# EAGLE schematic luxometro_16F1709 (EAGLE 7.1.0)
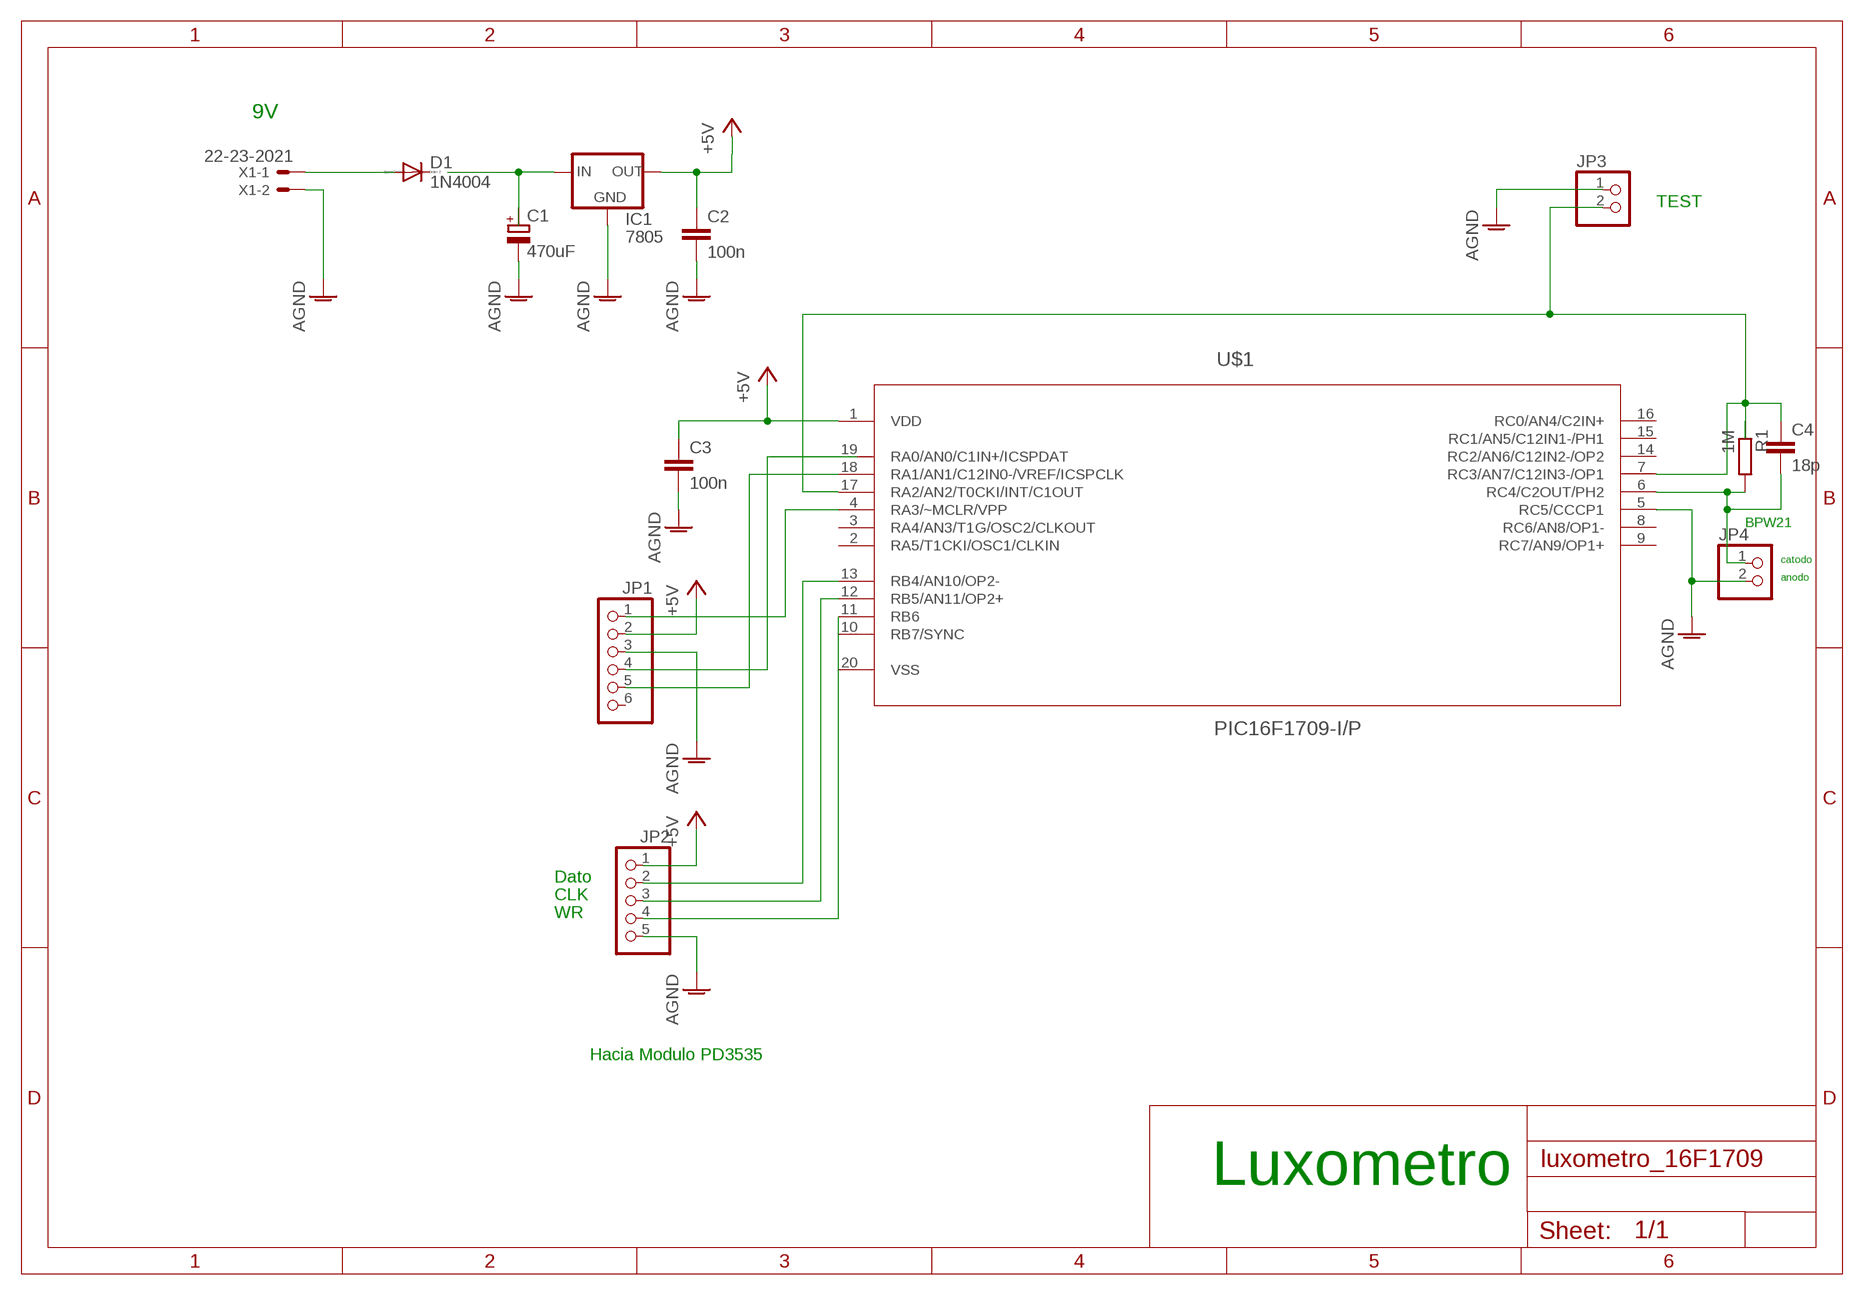
[diagram p0: schematic, sheet 1]

## Parts
C1  470uF  CPOL-EUE2,5-6E  [E2,5-6E]
C2  100n  C-EU050-024X044  [C050-024X044]
C3  100n  C-EU050-024X044  [C050-024X044]
C4  18p  C-EU050-024X044  [C050-024X044]
D1  1N4004  [DO41-10]
IC1  7805  78XXL  [78XXL]
JP1  PINHD-1X6  [1X06]
JP2  PINHD-1X5  [1X05]
JP3  PINHD-1X2  [1X02]
JP4  PINHD-1X2  [1X02]
R1  1M  R-EU_0204/5  [0204/5]
U$1  PIC16F1709-I/P  PIC16F785-I/P  [DIP254P762X533-20]
X1  22-23-2021  [22-23-2021]

## Nets
+5V: C2.1 C3.1 IC1.OUT JP1.2 JP2.1 U$1.1(VDD)
AGND: C1.- C2.2 C3.2 IC1.GND JP1.3 JP2.5 JP3.1 JP4.2 U$1.5(RC5/CCCP1) X1.2
N$1: JP1.1 U$1.4(RA3/~MCLR/VPP)
N$2: D1.A X1.1
N$3: C1.+ IC1.IN
N$4: JP1.4
N$5: JP2.2 U$1.13(RB4/AN10/OP2-)
N$6: JP1.5 U$1.18(RA1/AN1/C12IN0-/VREF/ICSPCLK)
N$7: C4.1 JP3.2 R1.1 U$1.7(RC3/AN7/C12IN3-/OP1) U$1.17(RA2/AN2/T0CKI/INT/C1OUT)
N$8: JP2.3 U$1.12(RB5/AN11/OP2+)
N$9: JP2.4 U$1.11(RB6)
N$12: C4.2 JP4.1 R1.2 U$1.6(RC4/C2OUT/PH2)
Unconnected: D1.C JP1.6 U$1.2(RA5/T1CKI/OSC1/CLKIN) U$1.3(RA4/AN3/T1G/OSC2/CLKOUT) U$1.8(RC6/AN8/OP1-) U$1.9(RC7/AN9/OP1+) U$1.10(RB7/SYNC) U$1.14(RC2/AN6/C12IN2-/OP2) U$1.15(RC1/AN5/C12IN1-/PH1) U$1.16(RC0/AN4/C2IN+) U$1.19(RA0/AN0/C1IN+/ICSPDAT)

## Notes on the sheet
- 9V
- TEST
- BPW21
- catodo
- anodo
- Dato
- CLK
- WR
- Hacia Modulo PD3535
- Luxometro

## Power pins joined to a net without a drawn wire
VSS: U$1.20(VSS)

## Library data of the parts
C1 = rcl:CPOL-EU: POLARIZED CAPACITOR, European symbol
C2-C4 = rcl:C-EU: CAPACITOR, European symbol
D1 = diode:1N4004: DIODE general purpose rectifier, 1 A
IC1 = v-reg:78XXL: VOLTAGE REGULATOR
JP1 = pinhead:PINHD-1X6: PIN HEADER
JP2 = pinhead:PINHD-1X5: PIN HEADER
JP3 JP4 = pinhead:PINHD-1X2: PIN HEADER
R1 = rcl:R-EU_: RESISTOR, European symbol
U$1 = Microchip_By_element14_Batch_1:PIC16F785-I/P: 8-Bit CMOS Flash Microcontrollers; DESCRIPTION: 8-Bit CMOS Flash Microcontrollers; MPN: PIC16F785-I/P; OC_FARNELL: 9321160; OC_NEWARK: 56J7566; PACKAGE: PDIP-20; SUPPLIER: Microchip
X1 = con-molex:22-23-2021: .100" (2.54mm) Center Header - 2 Pin; MF: MOLEX; MPN: 22-23-2021; OC_FARNELL: 1462926; OC_NEWARK: 25C3832